# Altium schematic sheet ST Link.SchDoc
size A
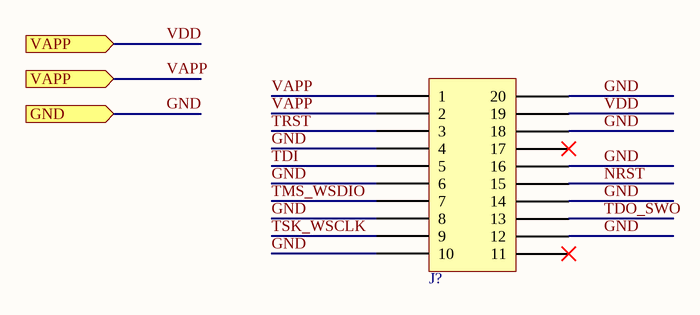
[diagram p0: ST Link.SchDoc]

## Parts
J?  61202021621  [WURTH 61202021621]  (value not drawn)

## Ports
GND (in), VAPP (in)

## Nets
GND: J?.4 J?.6 J?.8 J?.10 J?.12 J?.14 J?.16 J?.18 J?.20 ; port GND
NRST: J?.15
TDI: J?.5
TDO_SWO: J?.13
TMS_WSDIO: J?.7
TRST: J?.3
TSK_WSCLK: J?.9
VAPP: J?.1 J?.2 J?.19 ; port VAPP  [also labelled VDD]

Not connected (* = marked no-connect by the designer): J? 11* 17*

## Library data of the parts
J? = 61202021621: CONN HEADER VERT 20POS 2.54MM; Manufacturer: Würth Elektronik; Current Rating (Amps): 1A; Material Flammability Rating: UL94 V-0; Number of Positions: 20; Number of Positions Loaded: All; Pitch - Mating: 0.100" (2.54mm); Shrouding: Shrouded - 4 Wall; Style: Board to Cable/Wire; Voltage Rating: 250V; Part Number: 61202021621; ComponentLink1Description: Datasheet; ComponentLink1URL: https://media.digikey.com/pdf/Data%20Sheets/Wurth%20Electronics%20PDFs/Box%20Header_IDC%20Conn%20WR-BHD.pdf; ComponentLink2Description: DigiKey Link; ComponentLink2URL: https://www.digikey.com/en/products/detail/w%C3%BCrth-elektronik/61202021621/2060592; Connector Type: Header; Contact Finish - Mating: Gold; Contact Finish - Post: Tin; Contact Material: Copper Alloy; Contact Shape: Rectangular; Contact Type: Male Pin; Fastening Type: Push-Pull; Features: Keying Slot; Insulation Color: Black; Insulation Height: 0.358" (9.10mm); Insulation Material: Polybutylene Terephthalate (PBT); LastUpdated: 2020-10-20 8:24:21 PM; Lifecycle Status: Active; Minimum Order: 1; Mounting Type: Through Hole; Number of Rows: 2; Operating Temperature: -40°C ~ 125°C; Packaging: Tray; Part Status: Active; Price: 0.89; Series: WR-BHD; Supplier 1: DigiKey; Supplier Part Number 1: 732-2096-ND; Termination: Solder